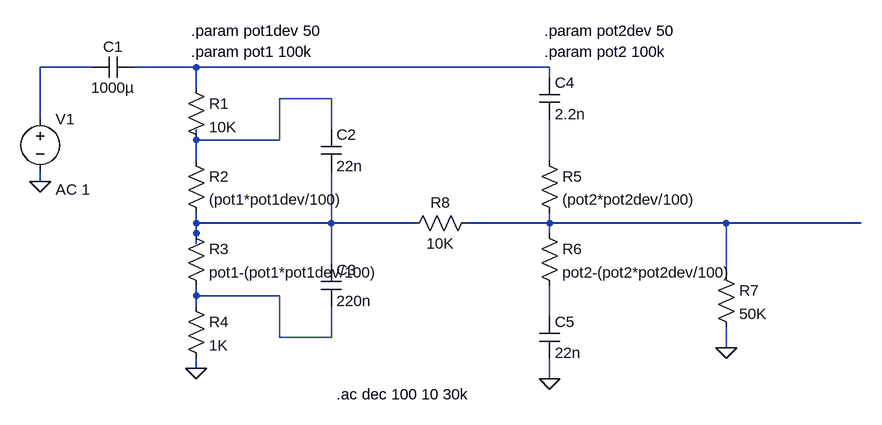
[diagram p0: schematic baxandal tone control kt.asc]
baxandal tone control kt.asc, the LTspice schematic file:
Version 4
SHEET 1 1320 680
WIRE 64 48 -16 48
WIRE 224 48 128 48
WIRE 768 48 224 48
WIRE 768 64 768 48
WIRE 224 80 224 48
WIRE 432 96 352 96
WIRE -16 128 -16 48
WIRE 432 144 432 96
WIRE 224 160 224 144
WIRE 352 160 352 96
WIRE 352 160 224 160
WIRE 224 192 224 160
WIRE 768 192 768 128
WIRE -16 224 -16 208
WIRE 224 288 224 272
WIRE 432 288 432 208
WIRE 432 288 224 288
WIRE 560 288 432 288
WIRE 768 288 768 272
WIRE 768 288 640 288
WIRE 1040 288 768 288
WIRE 1248 288 1040 288
WIRE 224 304 224 288
WIRE 768 304 768 288
WIRE 224 320 224 304
WIRE 432 352 432 288
WIRE 1040 368 1040 288
WIRE 224 400 224 384
WIRE 352 400 224 400
WIRE 224 416 224 400
WIRE 768 432 768 384
WIRE 352 464 352 400
WIRE 432 464 432 416
WIRE 432 464 352 464
WIRE 1040 480 1040 448
WIRE 224 512 224 496
WIRE 768 528 768 496
FLAG -16 224 0
FLAG 224 512 0
FLAG 768 528 0
FLAG 1040 480 0
SYMBOL voltage -16 112 R0
WINDOW 123 24 124 Left 2
WINDOW 39 0 0 Left 0
SYMATTR InstName V1
SYMATTR Value ""
SYMATTR Value2 AC 1
SYMBOL cap 128 32 R90
WINDOW 0 0 32 VBottom 2
WINDOW 3 32 32 VTop 2
SYMATTR InstName C1
SYMATTR Value 1000µ
SYMBOL res 208 64 R0
SYMATTR InstName R1
SYMATTR Value 10K
SYMBOL res 208 176 R0
SYMATTR InstName R2
SYMATTR Value (pot1*pot1dev/100)
SYMBOL res 208 288 R0
SYMATTR InstName R3
SYMATTR Value pot1-(pot1*pot1dev/100)
SYMBOL res 208 400 R0
SYMATTR InstName R4
SYMATTR Value 1K
SYMBOL res 752 176 R0
SYMATTR InstName R5
SYMATTR Value (pot2*pot2dev/100)
SYMBOL res 752 288 R0
SYMATTR InstName R6
SYMATTR Value pot2-(pot2*pot2dev/100)
SYMBOL res 1024 352 R0
SYMATTR InstName R7
SYMATTR Value 50K
SYMBOL cap 416 144 R0
SYMATTR InstName C2
SYMATTR Value 22n
SYMBOL cap 416 352 R0
SYMATTR InstName C3
SYMATTR Value 220n
SYMBOL cap 752 64 R0
SYMATTR InstName C4
SYMATTR Value 2.2n
SYMBOL cap 752 432 R0
SYMATTR InstName C5
SYMATTR Value 22n
SYMBOL res 656 272 R90
WINDOW 0 0 56 VBottom 2
WINDOW 3 32 56 VTop 2
SYMATTR InstName R8
SYMATTR Value 10K
TEXT 216 24 Left 2 !.param pot1 100k
TEXT 760 24 Left 2 !.param pot2 100k
TEXT 216 -8 Left 2 !.param pot1dev 50
TEXT 760 -8 Left 2 !.param pot2dev 50
TEXT 440 552 Left 2 !.ac dec 100 10 30k

The netlist it stands for:
* baxandal tone control kt.asc
V1 N001 0 AC 1
C1 N002 N001 1000µ
R1 N002 N003 10K
R2 N003 N005 (pot1*pot1dev/100)
R3 N005 N007 pot1-(pot1*pot1dev/100)
R4 N007 0 1K
R5 N004 N006 (pot2*pot2dev/100)
R6 N006 N008 pot2-(pot2*pot2dev/100)
R7 N006 0 50K
C2 N003 N005 22n
C3 N005 N007 220n
C4 N002 N004 2.2n
C5 N008 0 22n
R8 N006 N005 10K
.param pot1 100k
.param pot2 100k
.param pot1dev 50
.param pot2dev 50
.ac dec 100 10 30k
.backanno
.end